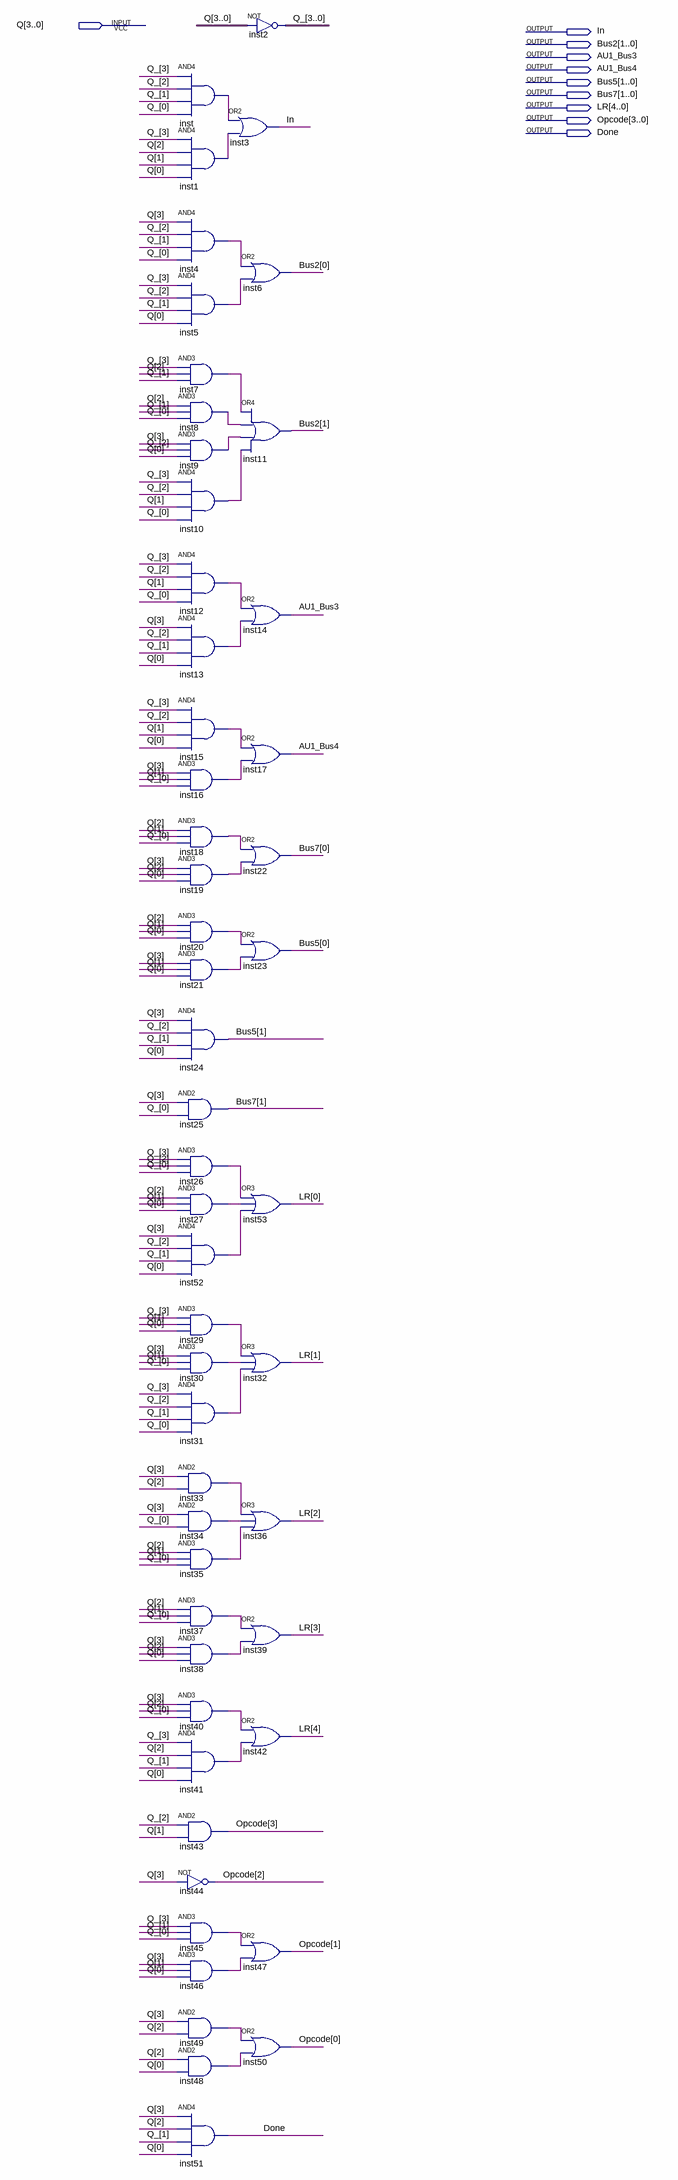
[diagram p0: schematic sheet]
// Quartus schematic Output_logic_version7.bdf as structural Verilog: 53 symbols, 10 pins
module Output_logic_version7 (
  input  [3:0] Q,
  output In,
  output [1:0] Bus2,
  output AU1_Bus3,
  output AU1_Bus4,
  output [1:0] Bus5,
  output [1:0] Bus7,
  output [4:0] LR,
  output [3:0] Opcode,
  output Done
);

  wire inst1_out, inst4_out, inst5_out, inst7_out, inst8_out, inst9_out, inst10_out, inst12_out, inst13_out,
       inst15_out, inst16_out, inst18_out, inst19_out, inst20_out, inst21_out, inst26_out, inst27_out,
       inst29_out, inst30_out, inst31_out, inst33_out, inst34_out, inst35_out, inst37_out, inst38_out,
       inst40_out, inst41_out, inst45_out, inst46_out, inst48_out, inst49_out, inst52_out, inst_out;
  wire [3:0] Q_;

  and inst (inst_out, Q_[3], Q_[2], Q_[1], Q_[0]);
  and inst1 (inst1_out, Q_[3], Q[2], Q[1], Q[0]);
  and inst4 (inst4_out, Q[3], Q_[2], Q_[1], Q_[0]);
  and inst5 (inst5_out, Q_[3], Q_[2], Q_[1], Q[0]);
  and inst7 (inst7_out, Q_[3], Q[2], Q_[1]);
  and inst8 (inst8_out, Q[2], Q_[1], Q_[0]);
  and inst9 (inst9_out, Q[3], Q_[2], Q[0]);
  and inst10 (inst10_out, Q_[3], Q_[2], Q[1], Q_[0]);
  and inst12 (inst12_out, Q_[3], Q_[2], Q[1], Q_[0]);
  and inst13 (inst13_out, Q[3], Q_[2], Q_[1], Q[0]);
  and inst15 (inst15_out, Q_[3], Q_[2], Q[1], Q[0]);
  and inst16 (inst16_out, Q[3], Q[1], Q_[0]);
  and inst18 (inst18_out, Q[2], Q[1], Q_[0]);
  and inst19 (inst19_out, Q[3], Q[2], Q[0]);
  and inst20 (inst20_out, Q[2], Q[1], Q[0]);
  and inst21 (inst21_out, Q[3], Q[1], Q[0]);
  and inst24 (Bus5[1], Q[3], Q_[2], Q_[1], Q[0]);
  and inst25 (Bus7[1], Q[3], Q_[0]);
  and inst26 (inst26_out, Q_[3], Q_[2], Q_[0]);
  and inst27 (inst27_out, Q[2], Q[1], Q[0]);
  and inst52 (inst52_out, Q[3], Q_[2], Q_[1], Q[0]);
  and inst29 (inst29_out, Q_[3], Q[1], Q[0]);
  and inst30 (inst30_out, Q[3], Q[1], Q_[0]);
  and inst31 (inst31_out, Q_[3], Q_[2], Q_[1], Q_[0]);
  and inst33 (inst33_out, Q[3], Q[2]);
  and inst34 (inst34_out, Q[3], Q_[0]);
  and inst35 (inst35_out, Q[2], Q[1], Q_[0]);
  and inst37 (inst37_out, Q[2], Q[1], Q_[0]);
  and inst38 (inst38_out, Q[3], Q[2], Q[0]);
  and inst40 (inst40_out, Q[3], Q[2], Q_[0]);
  and inst41 (inst41_out, Q_[3], Q[2], Q_[1], Q[0]);
  and inst43 (Opcode[3], Q_[2], Q[1]);
  not inst44 (Opcode[2], Q[3]);
  and inst45 (inst45_out, Q_[3], Q_[1], Q_[0]);
  and inst46 (inst46_out, Q[3], Q[1], Q[0]);
  and inst49 (inst49_out, Q[3], Q[2]);
  and inst48 (inst48_out, Q[2], Q[0]);
  and inst51 (Done, Q[3], Q[2], Q_[1], Q[0]);
  or inst3 (In, inst_out, inst1_out);
  assign Q_ = ~Q;  // NOT inst2, 4 bits wide
  or inst6 (Bus2[0], inst4_out, inst5_out);
  or inst11 (Bus2[1], inst7_out, inst8_out, inst9_out, inst10_out);
  or inst14 (AU1_Bus3, inst12_out, inst13_out);
  or inst17 (AU1_Bus4, inst15_out, inst16_out);
  or inst22 (Bus7[0], inst18_out, inst19_out);
  or inst23 (Bus5[0], inst20_out, inst21_out);
  or inst53 (LR[0], inst26_out, inst27_out, inst52_out);
  or inst32 (LR[1], inst29_out, inst30_out, inst31_out);
  or inst36 (LR[2], inst33_out, inst34_out, inst35_out);
  or inst39 (LR[3], inst37_out, inst38_out);
  or inst42 (LR[4], inst40_out, inst41_out);
  or inst47 (Opcode[1], inst45_out, inst46_out);
  or inst50 (Opcode[0], inst49_out, inst48_out);
endmodule
